# EAGLE schematic RN4020F-2A (EAGLE 7.5.0)
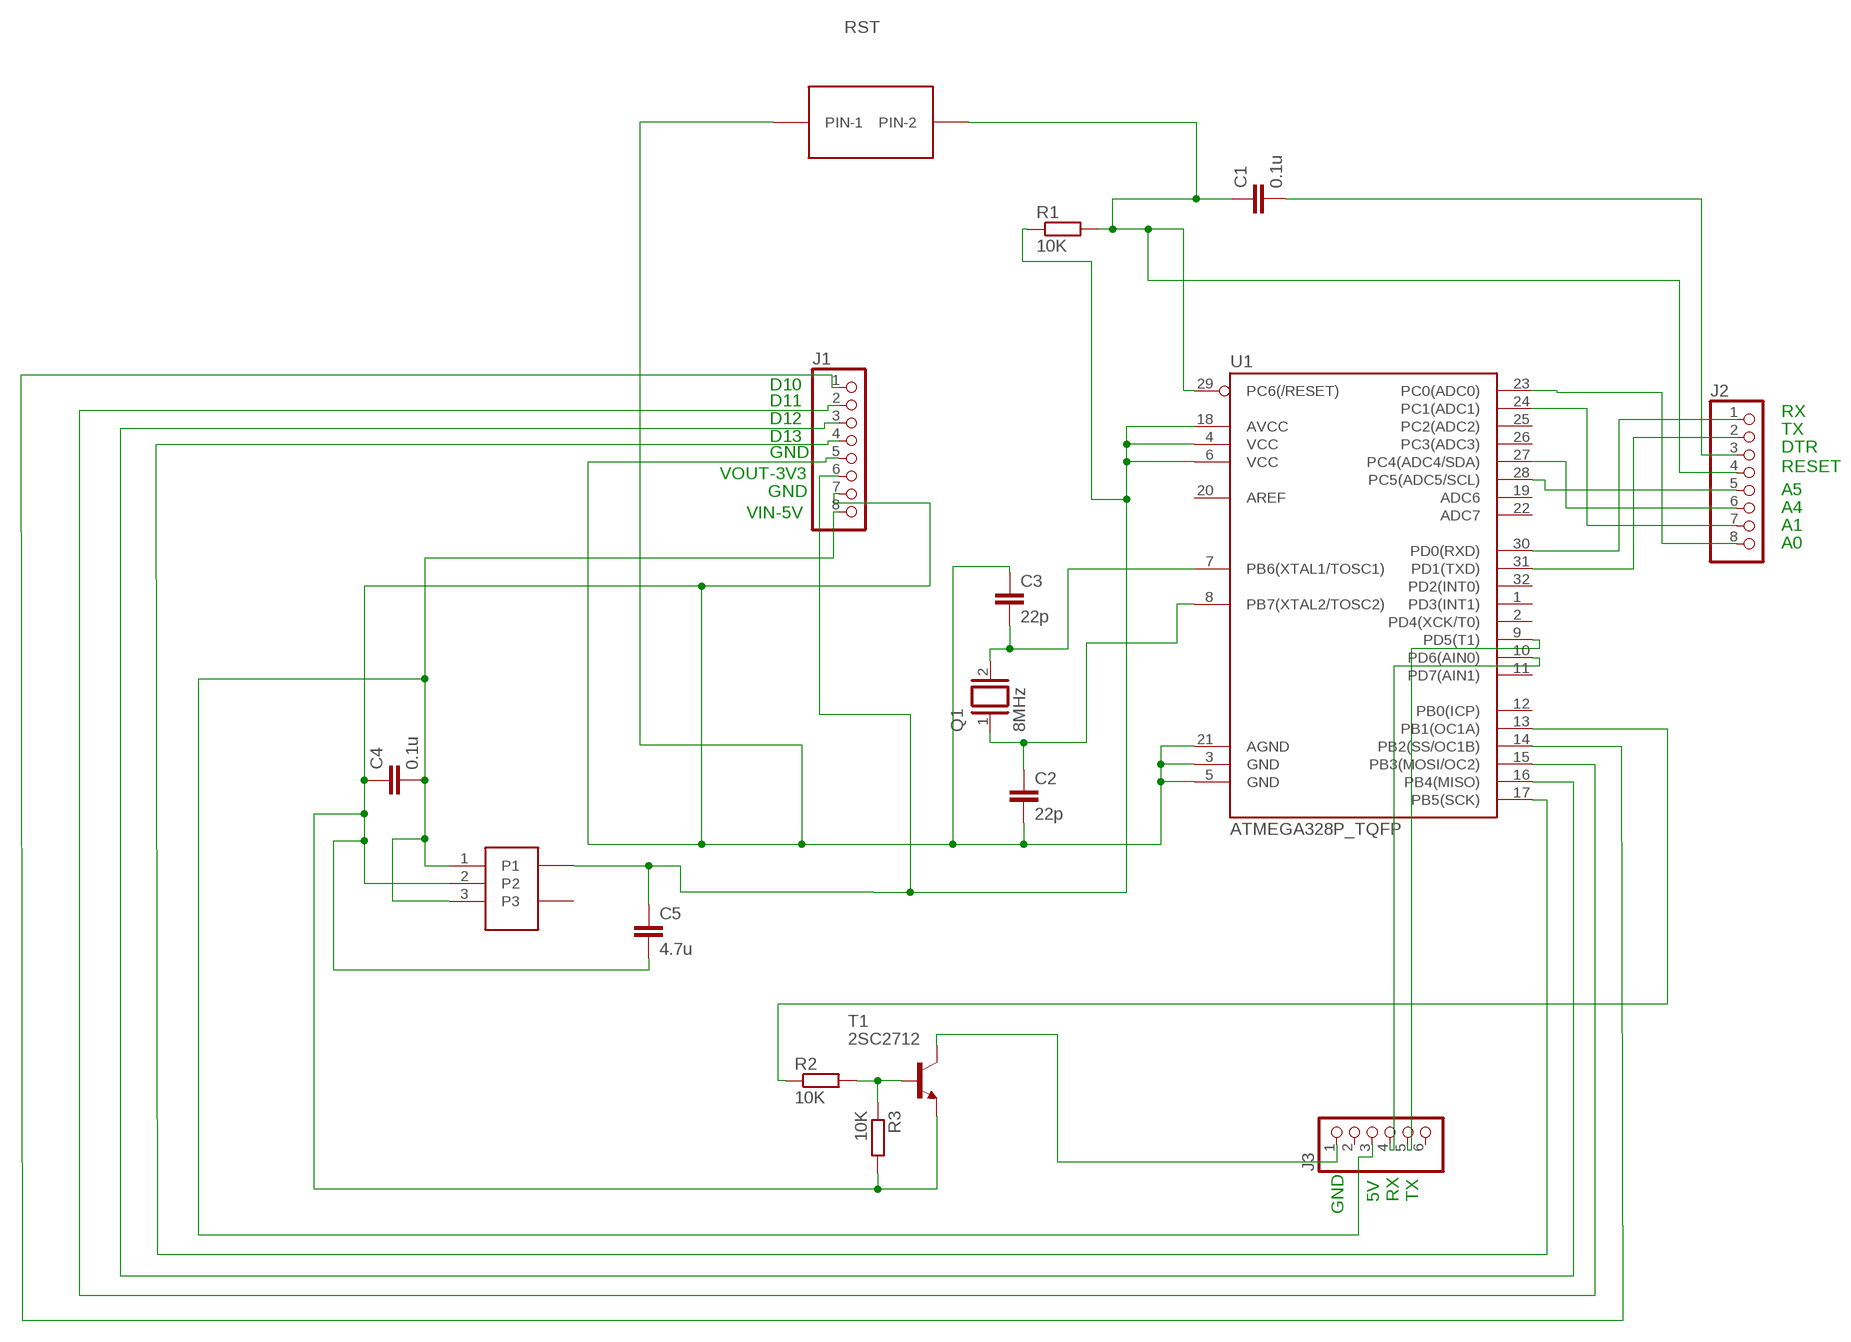
[diagram p0: schematic, sheet 1]

## Parts
C1  0.1u  C-EUC0603  [C0603]
C2  22p  C-EUC0603  [C0603]
C3  22p  C-EUC0603  [C0603]
C4  0.1u  C-EUC0603  [C0603]
C5  4.7u  C-EUC1206  [C1206]
J1  PINHD-1X8  [1X08]
J2  PINHD-1X8  [1X08]
J3  PINHD-1X6  [1X06]
Q1  8MHz  XTAL/S  [QS]
R1  10K  R-EU_R0603  [R0603]
R2  10K  R-EU_R0603  [R0603]
R3  10K  R-EU_R0603  [R0603]
RST  BTN2-EX  [B3F-10XX]
T1  2SC2712  BC846  [SOT23]
U1  ATMEGA328P_TQFP  [TQFP32-08]
U2  NJM2866F33  [SOT23-3]

## Nets
N$1: C2.2 C3.1 C4.1 C5.2 J1.5 J1.7 R3.2 RST.1(PIN-1) T1.2(E) U1.3(GND) U1.5(GND) U1.21(AGND) U2.2
N$4: J2.7 U1.24(PC1(ADC1))
N$5: J2.1 U1.30(PD0(RXD))
N$6: J2.2 U1.31(PD1(TXD))
N$7: J1.1 U1.14(PB2(SS/OC1B))
N$8: J1.2 U1.15(PB3(MOSI/OC2))
N$9: C5.1 J1.6 R1.1 U1.4(VCC) U1.6(VCC) U1.18(AVCC) U2.5
N$11: C3.2 Q1.2 U1.7(PB6(XTAL1/TOSC1))
N$12: C2.1 Q1.1 U1.8(PB7(XTAL2/TOSC2))
N$13: J2.8 U1.23(PC0(ADC0))
N$14: J2.5 U1.28(PC5(ADC5/SCL))
N$15: C4.2 J1.8 J3.3 U2.1 U2.3
N$16: J2.6 U1.27(PC4(ADC4/SDA))
N$17: C1.1 J2.4 R1.2 RST.2(PIN-2) U1.29(PC6(/RESET))
N$18: J3.5 U1.9(PD5(T1))
N$19: J1.3 U1.16(PB4(MISO))
N$20: J1.4 U1.17(PB5(SCK))
N$21: J3.4 U1.10(PD6(AIN0))
N$22: C1.2 J2.3
N$23: R2.1 U1.13(PB1(OC1A))
N$24: R2.2 R3.1 T1.1(B)
N$26: J3.1 T1.3(C)
Unconnected: J3.2 J3.6 U1.1(PD3(INT1)) U1.2(PD4(XCK/T0)) U1.11(PD7(AIN1)) U1.12(PB0(ICP)) U1.19(ADC6) U1.20(AREF) U1.22(ADC7) U1.25(PC2(ADC2)) U1.26(PC3(ADC3)) U1.32(PD2(INT0)) U2.4

## Notes on the sheet
- D10
- D11
- RX
- D12
- TX
- D13
- DTR
- GND
- RESET
- VOUT-3V3
- GND | A5
- A4
- VIN-5V
- A1
- A0
- 5V | RX | TX
- GND

## Library data of the parts
C1-C5 = resistor:C-EU: CAPACITOR, European symbol
J1 J2 = pinhead:PINHD-1X8: PIN HEADER
J3 = pinhead:PINHD-1X6: PIN HEADER
Q1 = special:XTAL/S: CRYSTAL
R1-R3 = resistor:R-EU_: RESISTOR, European symbol
RST = btn2-ex2:BTN2-EX
T1 = transistor:BC846: NPN TRANSISTOR
U1 = SparkFun-DigitalIC:ATMEGA328P_TQFP; PROD_ID: IC-09069
U2 = SparkFun-DiscreteSemi-ext:NJM2866F33